# Altium project hau1906.PrjPCB
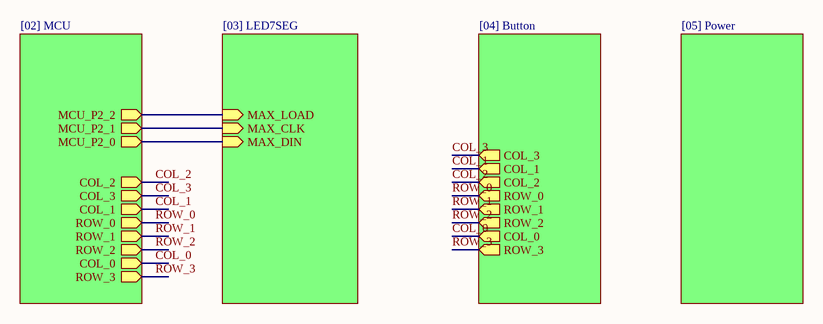
[diagram p0: hau1906.SchDoc]
5 sheets, 31 parts. Net scope: hierarchical (ports join the sheet entries above them; power ports are global).
Board file: hau1906.PcbDoc
Sheets:
  hau1906.SchDoc
    02 = [02] MCU.SchDoc
    03 = [03] LED7SEG.SchDoc
    04 = [04] Button.SchDoc
    05 = [05] Power.SchDoc

## Sheet hau1906.SchDoc
size A

### Sub-sheets
02 = [02] MCU: MCU_P2_0 (out), MCU_P2_1 (out), MCU_P2_2 (out), COL_2 (out), COL_3 (out), COL_1 (out), ROW_0 (out), ROW_1 (out), ROW_2 (out), COL_0 (out), ROW_3 (out)
03 = [03] LED7SEG: MAX_LOAD (in), MAX_CLK (in), MAX_DIN (in)
04 = [04] Button: COL_3 (out), COL_1 (out), COL_2 (out), ROW_0 (out), ROW_1 (out), ROW_2 (out), COL_0 (out), ROW_3 (out)
05 = [05] Power: no entries

### Nets
COL_0: sheet 02/COL_0, sheet 04/COL_0
COL_1: sheet 02/COL_1, sheet 04/COL_1
COL_2: sheet 02/COL_2, sheet 04/COL_2
COL_3: sheet 02/COL_3, sheet 04/COL_3
ROW_0: sheet 02/ROW_0, sheet 04/ROW_0
ROW_1: sheet 02/ROW_1, sheet 04/ROW_1
ROW_2: sheet 02/ROW_2, sheet 04/ROW_2
ROW_3: sheet 02/ROW_3, sheet 04/ROW_3
NetIC1_21: sheet 02/MCU_P2_0, sheet 03/MAX_DIN
NetIC1_22: sheet 02/MCU_P2_1, sheet 03/MAX_CLK
NetIC1_23: sheet 02/MCU_P2_2, sheet 03/MAX_LOAD

## Sheet [02] MCU.SchDoc
size A
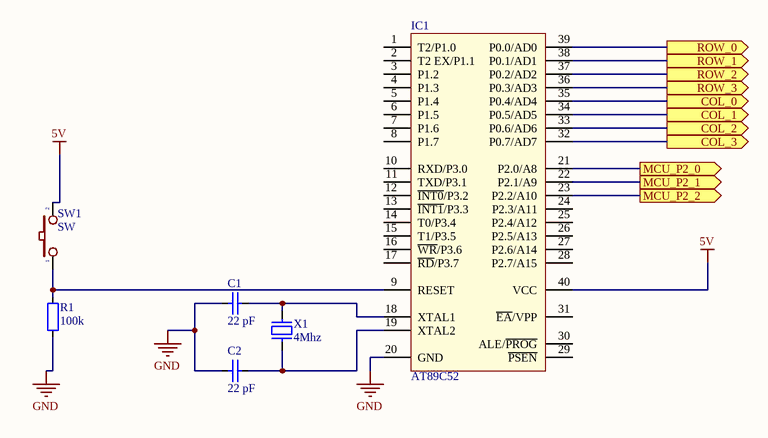
[diagram p1: [02] MCU.SchDoc]

### Parts
C1  22 pF  [CAP_0402]
C2  22 pF  [CAP_0402]
IC1  AT89C52  [DIP40/W0.6]
R1  100k  [RES-SMD-0805]
SW1  SW  [SW2]
X1  4Mhz  [XT2]

### Ports
COL_0 (out), COL_1 (out), COL_2 (out), COL_3 (out), MCU_P2_0 (out), MCU_P2_1 (out), MCU_P2_2 (out), ROW_0 (out), ROW_1 (out), ROW_2 (out), ROW_3 (out)

### Nets
5V: IC1.40(VCC) SW1.2
GND: C1.1 C2.2 IC1.20(GND) R1.1
COL_0: IC1.35(P0.4/AD4) ; port COL_0
COL_1: IC1.34(P0.5/AD5) ; port COL_1
COL_2: IC1.33(P0.6/AD6) ; port COL_2
COL_3: IC1.32(P0.7/AD7) ; port COL_3
ROW_0: IC1.39(P0.0/AD0) ; port ROW_0
ROW_1: IC1.38(P0.1/AD1) ; port ROW_1
ROW_2: IC1.37(P0.2/AD2) ; port ROW_2
ROW_3: IC1.36(P0.3/AD3) ; port ROW_3
NetC1_2: C1.2 IC1.18(XTAL1) X1.1
NetC2_1: C2.1 IC1.19(XTAL2) X1.2
NetIC1_9: IC1.9(RESET) R1.2 SW1.1
NetIC1_21: IC1.21(P2.0/A8) ; port MCU_P2_0
NetIC1_22: IC1.22(P2.1/A9) ; port MCU_P2_1
NetIC1_23: IC1.23(P2.2/A10) ; port MCU_P2_2

Not connected (* = marked no-connect by the designer): IC1 1(T2/P1.0) 2(T2_EX/P1.1) 3(P1.2) 4(P1.3) 5(P1.4) 6(P1.5) 7(P1.6) 8(P1.7) 10(RXD/P3.0) 11(TXD/P3.1) 12(~{INT0}/P3.2) 13(~{INT1}/P3.3) 14(T0/P3.4) 15(T1/P3.5) 16(~{WR}/P3.6) 17(~{RD}/P3.7) 24(P2.3/A11) 25(P2.4/A12) 26(P2.5/A13) 27(P2.6/A14) 28(P2.7/A15) 29(~{PSEN}) 30(ALE/~{PROG}) 31(~{EA}/VPP)

### Library data of the parts
C1 C2 = CapSMD: Capacitor; Value: 33p; Published: 8-Jun-2000; LatestRevisionDate: 17-Jul-2002; LatestRevisionNote: Re-released for DXP Platform.; PackageReference: RAD-0.3; Publisher: Altium Limited
IC1 = AT89C52: Atmel AT89C52, 8k Byte Flash Memory , 40 Pin; Value: AT89C52
R1 = Resistor - SMD: Resistor; Manufacturer: Generic Components; Class: Passive; Published: 08/06/2000; Publisher: Altium Hobart Technology Centre
SW1 = SW2: Switch button 2 pin; Value: SW chip 2 pin
X1 = XT2: Crystal For all Crystal 2pin.; Value: 4Mhz

## Sheet [03] LED7SEG.SchDoc
size A
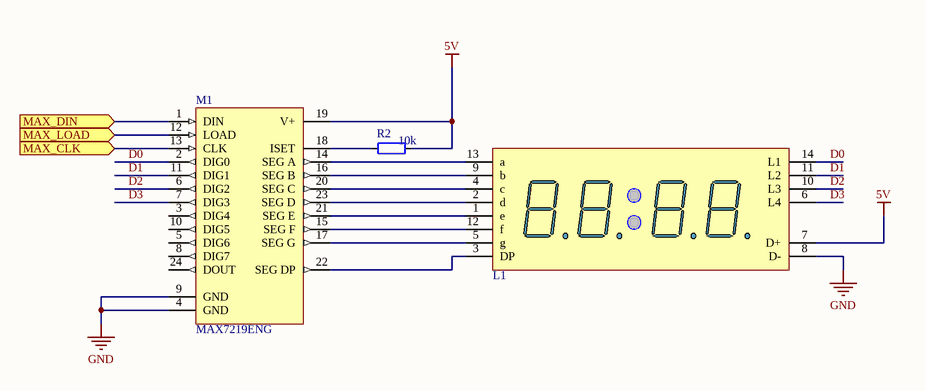
[diagram p2: [03] LED7SEG.SchDoc]

### Parts
L1  Led 7 Seg 4 digit - Anode  [LED7SEG-4-0.56-RG]  (value not drawn)
M1  MAX7219ENG  [SO24]
R2  10k  [RES-SMD-0805]

### Ports
MAX_CLK (in), MAX_DIN (in), MAX_LOAD (in)

### Nets
5V: L1.7(D+) M1.19(V+) R2.2
GND: L1.8(D-) M1.4(GND) M1.9(GND)
D0: L1.14(L1) M1.2(DIG0)
D1: L1.11(L2) M1.11(DIG1)
D2: L1.10(L3) M1.6(DIG2)
D3: L1.6(L4) M1.7(DIG3)
NetIC1_21: M1.1(DIN) ; port MAX_DIN
NetIC1_22: M1.13(CLK) ; port MAX_CLK
NetIC1_23: M1.12(LOAD) ; port MAX_LOAD
NetL1_1: L1.1(e) M1.21(SEG_E)
NetL1_2: L1.2(d) M1.23(SEG_D)
NetL1_3: L1.3(DP) M1.22(SEG_DP)
NetL1_4: L1.4(c) M1.20(SEG_C)
NetL1_5: L1.5(g) M1.17(SEG_G)
NetL1_9: L1.9(b) M1.16(SEG_B)
NetL1_12: L1.12(f) M1.15(SEG_F)
NetL1_13: L1.13(a) M1.14(SEG_A)
NetM1_18: M1.18(ISET) R2.1

Not connected (* = marked no-connect by the designer): M1 3(DIG4) 5(DIG6) 8(DIG7) 10(DIG5) 24(DOUT)

### Library data of the parts
L1 = LED7SEG-4-RG
M1 = MAX7219ENG: Serially Interfaced, 8-Digit LED Display Driver; Published: 16-Jan-2001; LatestRevisionDate: 29-May-2009; LatestRevisionNote: Component Body Added.; DatasheetVersion: Jul-1997; PackageVersion: 1997; PackageReference: NG24A; Publisher: Altium Limited; PackageDescription: DIP, 24-Pin, Row Spacing 7.62 mm, Pitch 2.54 mm; Code_JEDEC: MS-001-AF; ComponentLink1Description: Manufacturer Link; ComponentLink1URL: http://www.maxim-ic.com/; ComponentLink2Description: Datasheet; ComponentLink2URL: http://pdfserv.maxim-ic.com/en/ds/MAX7219-MAX7221.pdf
R2 = Resistor - SMD: as R1 on sheet [02] MCU; Published: 08/06/2000; Publisher: Altium Hobart Technology Centre

## Sheet [04] Button.SchDoc
size A
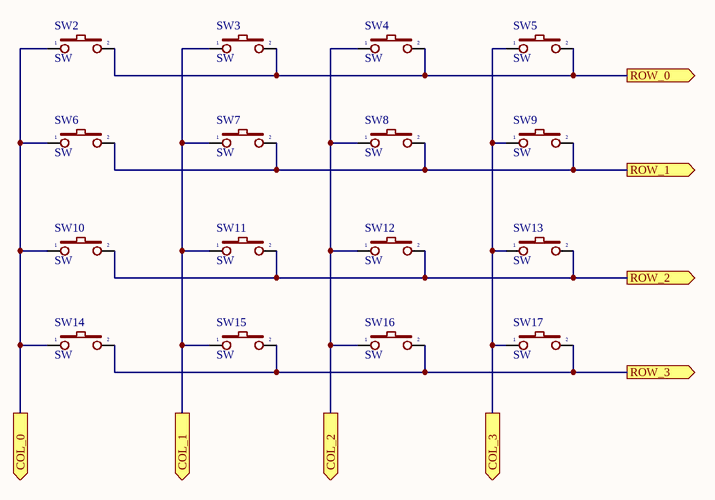
[diagram p3: [04] Button.SchDoc]

### Parts
SW2  SW  [SW2]
SW3  SW  [SW2]
SW4  SW  [SW2]
SW5  SW  [SW2]
SW6  SW  [SW2]
SW7  SW  [SW2]
SW8  SW  [SW2]
SW9  SW  [SW2]
SW10  SW  [SW2]
SW11  SW  [SW2]
SW12  SW  [SW2]
SW13  SW  [SW2]
SW14  SW  [SW2]
SW15  SW  [SW2]
SW16  SW  [SW2]
SW17  SW  [SW2]

### Ports
COL_0 (out), COL_1 (out), COL_2 (out), COL_3 (out), ROW_0 (out), ROW_1 (out), ROW_2 (out), ROW_3 (out)

### Nets
COL_0: SW2.1 SW6.1 SW10.1 SW14.1 ; port COL_0
COL_1: SW3.1 SW7.1 SW11.1 SW15.1 ; port COL_1
COL_2: SW4.1 SW8.1 SW12.1 SW16.1 ; port COL_2
COL_3: SW5.1 SW9.1 SW13.1 SW17.1 ; port COL_3
ROW_0: SW2.2 SW3.2 SW4.2 SW5.2 ; port ROW_0
ROW_1: SW6.2 SW7.2 SW8.2 SW9.2 ; port ROW_1
ROW_2: SW10.2 SW11.2 SW12.2 SW13.2 ; port ROW_2
ROW_3: SW14.2 SW15.2 SW16.2 SW17.2 ; port ROW_3

### Library data of the parts
SW2-SW17 = SW2: as SW1 on sheet [02] MCU

## Sheet [05] Power.SchDoc
size A
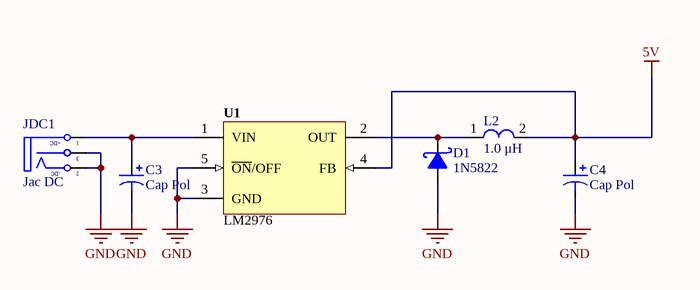
[diagram p4: [05] Power.SchDoc]

### Parts
C3  Cap Pol  [C3MM]
C4  Cap Pol  [C3MM]
D1  1N5822  [DIO-SMD-123]
JDC1  Jac DC  [DC-IN]
L2  1.0 μH  [L-SMD-M-7.3x4.5]
U1  LM2976  [TO263]

### Nets
5V: C4.1 L2.2 U1.4(FB)
GND: C3.2 C4.2 D1.1(A) JDC1.2(TN) JDC1.3(S) U1.3(GND) U1.5(~{ON}/OFF)
NetC3_1: C3.1 JDC1.1(T) U1.1(VIN)
NetD1_2: D1.2(K) L2.1 U1.2(OUT)

### Notes on the sheet
- (in symbol DCIN) +DC; -DC

### Library data of the parts
C3 C4 = Cap Pol: Polarized Capacitor (Axial); Published: 8-Jun-2000; LatestRevisionDate: 17-Jul-2002; LatestRevisionNote: Re-released for DXP Platform.; PackageReference: POLAR0.8; Publisher: Altium Limited
D1 = 1N5822: Schottky Rectifiers; Value: Diode c?m 1N5408
JDC1 = DCIN: Jac DC input; Value: Jac DC
L2 = L-SMD-1: partNo: 78477010; Manufacturer: Wurth Elektronik; Inductance: 1.0 μH; ComponentLink1Description: Manufacturer; ComponentLink1URL: http://www.we-online.de; Created by: Baojun Chen; Created Date: Nov.2015; ComponentLink2Description: Datasheet; ComponentLink2URL: http://katalog.we-online.de/pbs/datasheet/78477010.pdf
U1 = LM2596: Max Input Voltage: 12 V; Max Output Current: 3 (6.0 peak) A; Max Output Voltage: mV; Category: IC-Power; Min Input Voltage: mV; Min Output Voltage: mV; Mounting Technology: Surface Mount; Status: Unreleased; Supply Voltage: mV; Temperature Range: -40 to +125 degC

## Nets that join several sheets
5V: [02] MCU (IC1.40 SW1.2), [03] LED7SEG (L1.7 M1.19 R2.2), [05] Power (C4.1 L2.2 U1.4)
GND: [02] MCU (C1.1 C2.2 IC1.20 R1.1), [03] LED7SEG (L1.8 M1.4 M1.9), [05] Power (7 pins)
COL_0: [02] MCU (IC1.35), [04] Button (SW2.1 SW6.1 SW10.1 SW14.1)
COL_1: [02] MCU (IC1.34), [04] Button (SW3.1 SW7.1 SW11.1 SW15.1)
COL_2: [02] MCU (IC1.33), [04] Button (SW4.1 SW8.1 SW12.1 SW16.1)
COL_3: [02] MCU (IC1.32), [04] Button (SW5.1 SW9.1 SW13.1 SW17.1)
NetIC1_21: [02] MCU (IC1.21), [03] LED7SEG (M1.1)
NetIC1_22: [02] MCU (IC1.22), [03] LED7SEG (M1.13)
NetIC1_23: [02] MCU (IC1.23), [03] LED7SEG (M1.12)
ROW_0: [02] MCU (IC1.39), [04] Button (SW2.2 SW3.2 SW4.2 SW5.2)
ROW_1: [02] MCU (IC1.38), [04] Button (SW6.2 SW7.2 SW8.2 SW9.2)
ROW_2: [02] MCU (IC1.37), [04] Button (SW10.2 SW11.2 SW12.2 SW13.2)
ROW_3: [02] MCU (IC1.36), [04] Button (SW14.2 SW15.2 SW16.2 SW17.2)